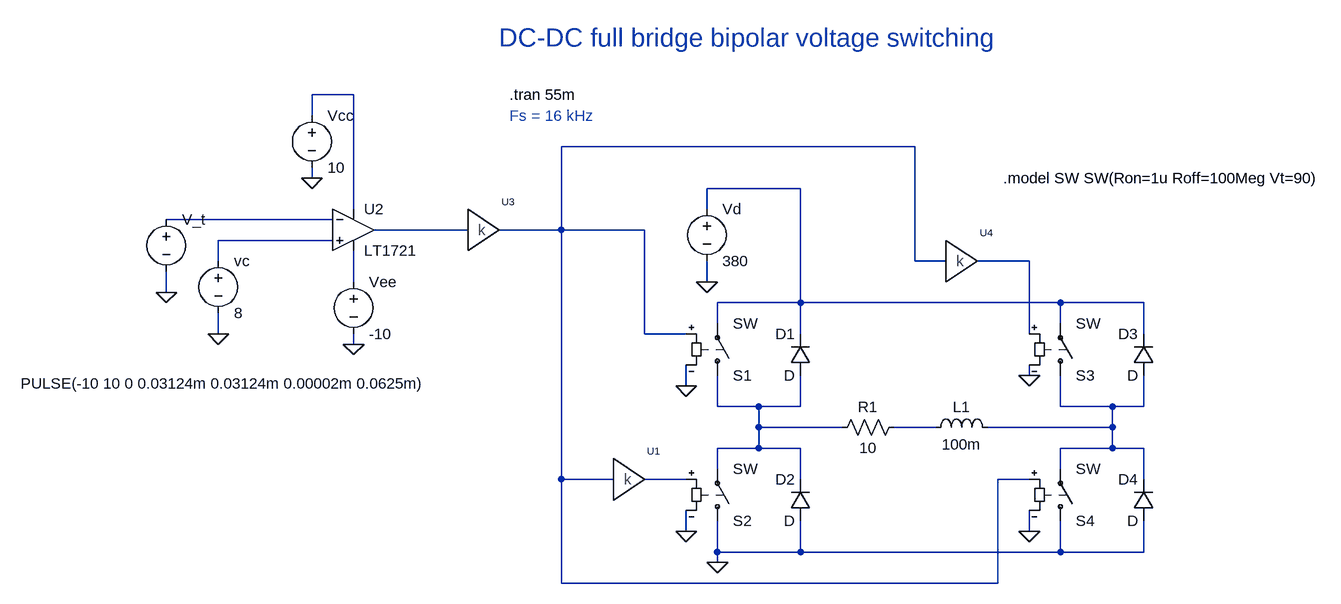
[diagram p0: schematic DCDC-full-bridge.asc]
DCDC-full-bridge.asc, the LTspice schematic file:
Version 4.1
SHEET 1 1180 680
WIRE -352 -288 -416 -288
WIRE -416 -256 -416 -288
WIRE 512 -208 -32 -208
WIRE -416 -160 -416 -176
WIRE 336 -144 192 -144
WIRE -352 -112 -352 -288
WIRE 192 -112 192 -144
WIRE -384 -96 -640 -96
WIRE -176 -80 -320 -80
WIRE -32 -80 -32 -208
WIRE -32 -80 -128 -80
WIRE 96 -80 -32 -80
WIRE -384 -64 -560 -64
WIRE -560 -32 -560 -64
WIRE 512 -32 512 -208
WIRE 560 -32 512 -32
WIRE 688 -32 608 -32
WIRE -352 0 -352 -48
WIRE 192 0 192 -32
WIRE -640 16 -640 -16
WIRE 336 32 336 -144
WIRE 336 32 208 32
WIRE 736 32 336 32
WIRE 864 32 736 32
WIRE 208 64 208 32
WIRE 736 64 736 32
WIRE -560 80 -560 48
WIRE 96 80 96 -80
WIRE 160 80 96 80
WIRE 336 80 336 32
WIRE 688 80 688 -32
WIRE 864 80 864 32
WIRE -352 96 -352 80
WIRE 688 144 688 128
WIRE 160 160 160 128
WIRE 208 192 208 144
WIRE 272 192 208 192
WIRE 336 192 336 144
WIRE 336 192 272 192
WIRE 736 192 736 144
WIRE 816 192 736 192
WIRE 864 192 864 144
WIRE 864 192 816 192
WIRE 272 224 272 192
WIRE 400 224 272 224
WIRE 544 224 480 224
WIRE 816 224 816 192
WIRE 816 224 624 224
WIRE 272 256 272 224
WIRE 272 256 208 256
WIRE 336 256 272 256
WIRE 816 256 816 224
WIRE 816 256 736 256
WIRE 864 256 816 256
WIRE 208 288 208 256
WIRE 736 288 736 256
WIRE -32 304 -32 -80
WIRE 48 304 -32 304
WIRE 160 304 96 304
WIRE 336 304 336 256
WIRE 688 304 640 304
WIRE 864 304 864 256
WIRE 160 384 160 352
WIRE 688 384 688 352
WIRE 208 416 208 368
WIRE 336 416 336 368
WIRE 336 416 208 416
WIRE 736 416 736 368
WIRE 736 416 336 416
WIRE 864 416 864 368
WIRE 864 416 736 416
WIRE 208 432 208 416
WIRE -32 464 -32 304
WIRE 640 464 640 304
WIRE 640 464 -32 464
FLAG 192 0 0
FLAG 688 384 0
FLAG 688 144 0
FLAG 208 432 0
FLAG 160 384 0
FLAG 160 160 0
FLAG -416 -160 0
FLAG -352 96 0
FLAG -560 80 0
FLAG -640 16 0
SYMBOL Gain 64 304 R0
SYMATTR InstName U1
SYMBOL sw 208 160 M180
SYMATTR InstName S1
SYMBOL voltage 192 -128 R0
WINDOW 123 0 0 Left 0
WINDOW 39 0 0 Left 0
SYMATTR InstName Vd
SYMATTR Value 380
SYMBOL diode 352 144 R180
WINDOW 0 24 64 Left 2
WINDOW 3 24 0 Left 2
SYMATTR InstName D1
SYMBOL diode 352 368 R180
WINDOW 0 24 64 Left 2
WINDOW 3 24 0 Left 2
SYMATTR InstName D2
SYMBOL sw 208 384 M180
SYMATTR InstName S2
SYMBOL diode 880 144 R180
WINDOW 0 24 64 Left 2
WINDOW 3 24 0 Left 2
SYMATTR InstName D3
SYMBOL sw 736 160 M180
SYMATTR InstName S3
SYMBOL diode 880 368 R180
WINDOW 0 24 64 Left 2
WINDOW 3 24 0 Left 2
SYMATTR InstName D4
SYMBOL sw 736 384 M180
SYMATTR InstName S4
SYMBOL res 384 240 R270
WINDOW 0 32 56 VTop 2
WINDOW 3 0 56 VBottom 2
SYMATTR InstName R1
SYMATTR Value 10
SYMBOL ind 528 240 R270
WINDOW 0 32 56 VTop 2
WINDOW 3 5 56 VBottom 2
SYMATTR InstName L1
SYMATTR Value 100m
SYMBOL voltage -640 -112 R0
WINDOW 3 -224 268 Left 2
WINDOW 123 0 0 Left 0
WINDOW 39 0 0 Left 0
SYMATTR Value PULSE(-10 10 0 0.03124m 0.03124m 0.00002m 0.0625m)
SYMATTR InstName V_t
SYMBOL voltage -560 -48 R0
WINDOW 123 0 0 Left 0
WINDOW 39 0 0 Left 0
SYMATTR InstName vc
SYMATTR Value 8
SYMBOL Comparators\\LT1721 -352 -144 R0
SYMATTR InstName U2
SYMBOL voltage -416 -272 R0
WINDOW 123 0 0 Left 0
WINDOW 39 0 0 Left 0
SYMATTR InstName Vcc
SYMATTR Value 10
SYMBOL voltage -352 -16 R0
WINDOW 123 0 0 Left 0
WINDOW 39 0 0 Left 0
SYMATTR InstName Vee
SYMATTR Value -10
SYMBOL Gain -160 -80 R0
SYMATTR SpiceLine G=100
SYMATTR InstName U3
SYMBOL Gain 576 -32 R0
SYMATTR InstName U4
TEXT 648 -160 Left 2 !.model SW SW(Ron=1u Roff=100Meg Vt=90)
TEXT -112 -288 Left 2 !.tran 55m
TEXT -128 -376 Left 4 ;DC-DC full bridge bipolar voltage switching
TEXT -112 -256 Left 2 ;Fs = 16 kHz

The netlist it stands for:
* DCDC-full-bridge.asc
E§U1 N002 N012 G={G}
S1 N009 N003 N002 0 SW
Vd N003 0 380
D1 N009 N003 D
D2 0 N009 D
S2 0 N009 N012 0 SW
D3 N010 N003 D
S3 N010 N003 N007 0 SW
D4 0 N010 D
S4 0 N010 N002 0 SW
R1 N009 N011 10
L1 N011 N010 100m
V_t N004 0 PULSE(-10 10 0 0.03124m 0.03124m 0.00002m 0.0625m)
vc N006 0 8
X§U2 N006 N004 N001 N008 N005 LT1720  ; LT1721, pins In+ In- V+ V- OUT
Vcc N001 0 10
Vee N008 0 -10
E§U3 N005 N002 G={G} G=100
E§U4 N002 N007 G={G}
.model D D
.lib standard.dio
.model SW SW(Ron=1u Roff=100Meg Vt=90)
.tran 55m
* DC-DC full bridge bipolar voltage switching
* Fs = 16 kHz
.lib LTC.lib
.backanno
.end